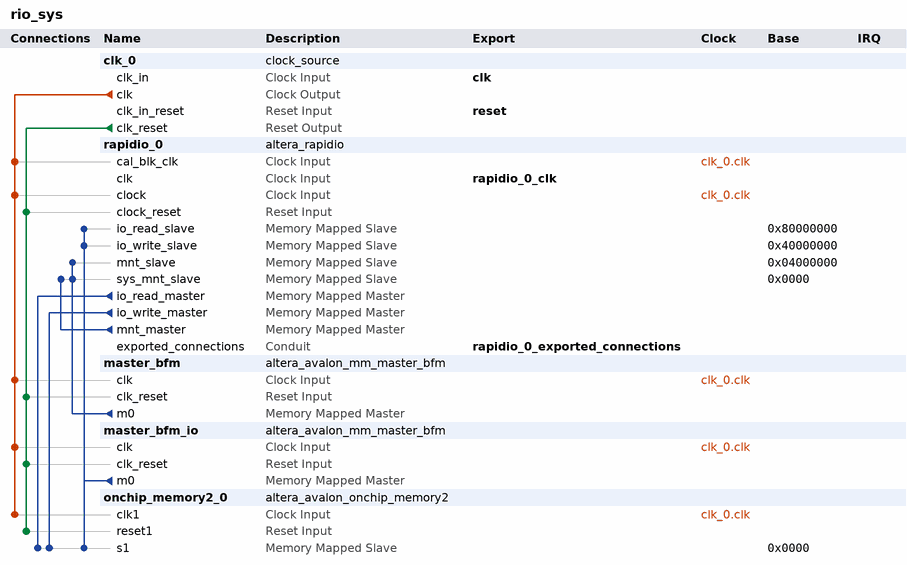
[diagram p0: system contents]
# Platform Designer (Qsys) system rio_sys
# Parameters at their usual value, and those the tool derives, are not listed.
package require -exact qsys 11.1
create_system rio_sys
set_project_property DEVICE_FAMILY STRATIXIV

add_instance clk_0 clock_source 11.1
set_instance_parameter_value clk_0 clockFrequency 50000000

add_instance rapidio_0 altera_rapidio 11.1
set_instance_parameter_value rapidio_0 mode_selection SERIAL_4X
set_instance_parameter_value rapidio_0 p_SYNC_ACKID false
set_instance_parameter_value rapidio_0 p_SEND_RESET_DEVICE false
set_instance_parameter_value rapidio_0 p_LINK_REQUEST_ATTEMPTS 7
set_instance_parameter_value rapidio_0 p_data_rate 2500
set_instance_parameter_value rapidio_0 p_ref_clk_freq 125
set_instance_parameter_value rapidio_0 p_RXBUFRSIZE 4
set_instance_parameter_value rapidio_0 p_TXBUFRSIZE 8
set_instance_parameter_value rapidio_0 auto_cfg_rx true
set_instance_parameter_value rapidio_0 p_rx_threshold_0 20
set_instance_parameter_value rapidio_0 p_rx_threshold_1 15
set_instance_parameter_value rapidio_0 p_rx_threshold_2 10
set_instance_parameter_value rapidio_0 p_TRANSPORT true
set_instance_parameter_value rapidio_0 p_TRANSPORT_LARGE false
set_instance_parameter_value rapidio_0 p_GENERIC_LOGICAL false
set_instance_parameter_value rapidio_0 p_PROMISCUOUS false
set_instance_parameter_value rapidio_0 rio_p_maintenance_master_slave AVALONMASTERSLAVE
set_instance_parameter_value rapidio_0 p_MAINTENANCE_WINDOWS 1
set_instance_parameter_value rapidio_0 p_TX_PORT_WRITE false
set_instance_parameter_value rapidio_0 p_RX_PORT_WRITE false
set_instance_parameter_value rapidio_0 rio_p_io_master_slave AVALONMASTERSLAVE
set_instance_parameter_value rapidio_0 p_IO_SLAVE_WIDTH 30
set_instance_parameter_value rapidio_0 p_READ_WRITE_ORDER false
set_instance_parameter_value rapidio_0 p_IO_MASTER_WINDOWS 1
set_instance_parameter_value rapidio_0 p_IO_SLAVE_WINDOWS 1
set_instance_parameter_value rapidio_0 p_DRBELL_TX false
set_instance_parameter_value rapidio_0 p_DRBELL_RX false
set_instance_parameter_value rapidio_0 p_DRBELL_WRITE_ORDER false
set_instance_parameter_value rapidio_0 p_DEVICE_ID 0
set_instance_parameter_value rapidio_0 p_DEVICE_VENDOR_ID 0
set_instance_parameter_value rapidio_0 p_DEVICE_REV 4294967295
set_instance_parameter_value rapidio_0 p_ASSEMBLY_ID 0
set_instance_parameter_value rapidio_0 p_ASSEMBLY_VENDOR_ID 0
set_instance_parameter_value rapidio_0 p_ASSEMBLY_REVISION 0
set_instance_parameter_value rapidio_0 p_FIRST_EF_PTR 256
set_instance_parameter_value rapidio_0 p_BRIDGE false
set_instance_parameter_value rapidio_0 p_MEMORY false
set_instance_parameter_value rapidio_0 p_PROCESSOR false
set_instance_parameter_value rapidio_0 p_SWITCH false
set_instance_parameter_value rapidio_0 p_PORT_TOTAL 1
set_instance_parameter_value rapidio_0 p_PORT_NUMBER 0
set_instance_parameter_value rapidio_0 p_SOURCE_OPERATION_DATA_MESSAGE false
set_instance_parameter_value rapidio_0 p_DESTINATION_OPERATION_DATA_MESSAGE false
set_instance_parameter_value rapidio_0 p_UNDER_SOPC false
set_instance_parameter_value rapidio_0 p_IO_SLAVE_OUTSTANDING_NREADS 16
set_instance_parameter_value rapidio_0 p_IO_SLAVE_OUTSTANDING_NWRITE_RS 8

add_instance master_bfm altera_avalon_mm_master_bfm 11.1
set_instance_parameter_value master_bfm AV_ADDRESS_W 32
set_instance_parameter_value master_bfm AV_NUMSYMBOLS 4
set_instance_parameter_value master_bfm AV_BURSTCOUNT_W 3
set_instance_parameter_value master_bfm AV_READRESPONSE_W 8
set_instance_parameter_value master_bfm AV_WRITERESPONSE_W 8
set_instance_parameter_value master_bfm USE_READ 1
set_instance_parameter_value master_bfm USE_BYTE_ENABLE 0
set_instance_parameter_value master_bfm USE_BURSTCOUNT 0
set_instance_parameter_value master_bfm USE_READ_DATA 1
set_instance_parameter_value master_bfm USE_READ_DATA_VALID 1
set_instance_parameter_value master_bfm USE_WAIT_REQUEST 1
set_instance_parameter_value master_bfm AV_CONSTANT_BURST_BEHAVIOR 1
set_instance_parameter_value master_bfm AV_BURST_LINEWRAP 0
set_instance_parameter_value master_bfm AV_BURST_BNDR_ONLY 0
set_instance_parameter_value master_bfm AV_FIX_READ_LATENCY 1
set_instance_parameter_value master_bfm AV_READ_WAIT_TIME 1
set_instance_parameter_value master_bfm ADDRESS_UNITS SYMBOLS

add_instance master_bfm_io altera_avalon_mm_master_bfm 11.1
set_instance_parameter_value master_bfm_io AV_ADDRESS_W 32
set_instance_parameter_value master_bfm_io AV_NUMSYMBOLS 8
set_instance_parameter_value master_bfm_io AV_BURSTCOUNT_W 6
set_instance_parameter_value master_bfm_io AV_READRESPONSE_W 8
set_instance_parameter_value master_bfm_io AV_WRITERESPONSE_W 8
set_instance_parameter_value master_bfm_io USE_READ 1
set_instance_parameter_value master_bfm_io USE_BYTE_ENABLE 1
set_instance_parameter_value master_bfm_io USE_BURSTCOUNT 1
set_instance_parameter_value master_bfm_io USE_READ_DATA 1
set_instance_parameter_value master_bfm_io USE_READ_DATA_VALID 1
set_instance_parameter_value master_bfm_io USE_WAIT_REQUEST 1
set_instance_parameter_value master_bfm_io AV_CONSTANT_BURST_BEHAVIOR 1
set_instance_parameter_value master_bfm_io AV_BURST_LINEWRAP 1
set_instance_parameter_value master_bfm_io AV_BURST_BNDR_ONLY 1
set_instance_parameter_value master_bfm_io AV_FIX_READ_LATENCY 1
set_instance_parameter_value master_bfm_io AV_READ_WAIT_TIME 1
set_instance_parameter_value master_bfm_io ADDRESS_UNITS SYMBOLS

add_instance onchip_memory2_0 altera_avalon_onchip_memory2 11.1
set_instance_parameter_value onchip_memory2_0 dataWidth 64
set_instance_parameter_value onchip_memory2_0 dualPort false
set_instance_parameter_value onchip_memory2_0 initMemContent true
set_instance_parameter_value onchip_memory2_0 initializationFileName onchip_memory2_0
set_instance_parameter_value onchip_memory2_0 memorySize 4096

# connections
add_connection clk_0.clk master_bfm.clk clock
add_connection clk_0.clk master_bfm_io.clk clock
add_connection clk_0.clk onchip_memory2_0.clk1 clock
add_connection clk_0.clk rapidio_0.cal_blk_clk clock
add_connection clk_0.clk rapidio_0.clock clock
add_connection clk_0.clk_reset master_bfm.clk_reset reset
add_connection clk_0.clk_reset master_bfm_io.clk_reset reset
add_connection clk_0.clk_reset onchip_memory2_0.reset1 reset
add_connection clk_0.clk_reset rapidio_0.clock_reset reset
add_connection master_bfm.m0 rapidio_0.mnt_slave avalon
set_connection_parameter_value master_bfm.m0/rapidio_0.mnt_slave baseAddress 0x04000000
add_connection master_bfm.m0 rapidio_0.sys_mnt_slave avalon
set_connection_parameter_value master_bfm.m0/rapidio_0.sys_mnt_slave baseAddress 0x0000
add_connection master_bfm_io.m0 onchip_memory2_0.s1 avalon
set_connection_parameter_value master_bfm_io.m0/onchip_memory2_0.s1 baseAddress 0x0000
add_connection master_bfm_io.m0 rapidio_0.io_read_slave avalon
set_connection_parameter_value master_bfm_io.m0/rapidio_0.io_read_slave baseAddress 0x80000000
add_connection master_bfm_io.m0 rapidio_0.io_write_slave avalon
set_connection_parameter_value master_bfm_io.m0/rapidio_0.io_write_slave baseAddress 0x40000000
add_connection rapidio_0.io_read_master onchip_memory2_0.s1 avalon
set_connection_parameter_value rapidio_0.io_read_master/onchip_memory2_0.s1 baseAddress 0x0000
add_connection rapidio_0.io_write_master onchip_memory2_0.s1 avalon
set_connection_parameter_value rapidio_0.io_write_master/onchip_memory2_0.s1 baseAddress 0x0000
add_connection rapidio_0.mnt_master rapidio_0.sys_mnt_slave avalon
set_connection_parameter_value rapidio_0.mnt_master/rapidio_0.sys_mnt_slave baseAddress 0x0000

# exported interfaces
add_interface clk clock sink
set_interface_property clk EXPORT_OF clk_0.clk_in
add_interface reset reset sink
set_interface_property reset EXPORT_OF clk_0.clk_in_reset
add_interface rapidio_0_clk clock sink
set_interface_property rapidio_0_clk EXPORT_OF rapidio_0.clk
add_interface rapidio_0_exported_connections conduit end
set_interface_property rapidio_0_exported_connections EXPORT_OF rapidio_0.exported_connections

save_system rio_sys.qsys
